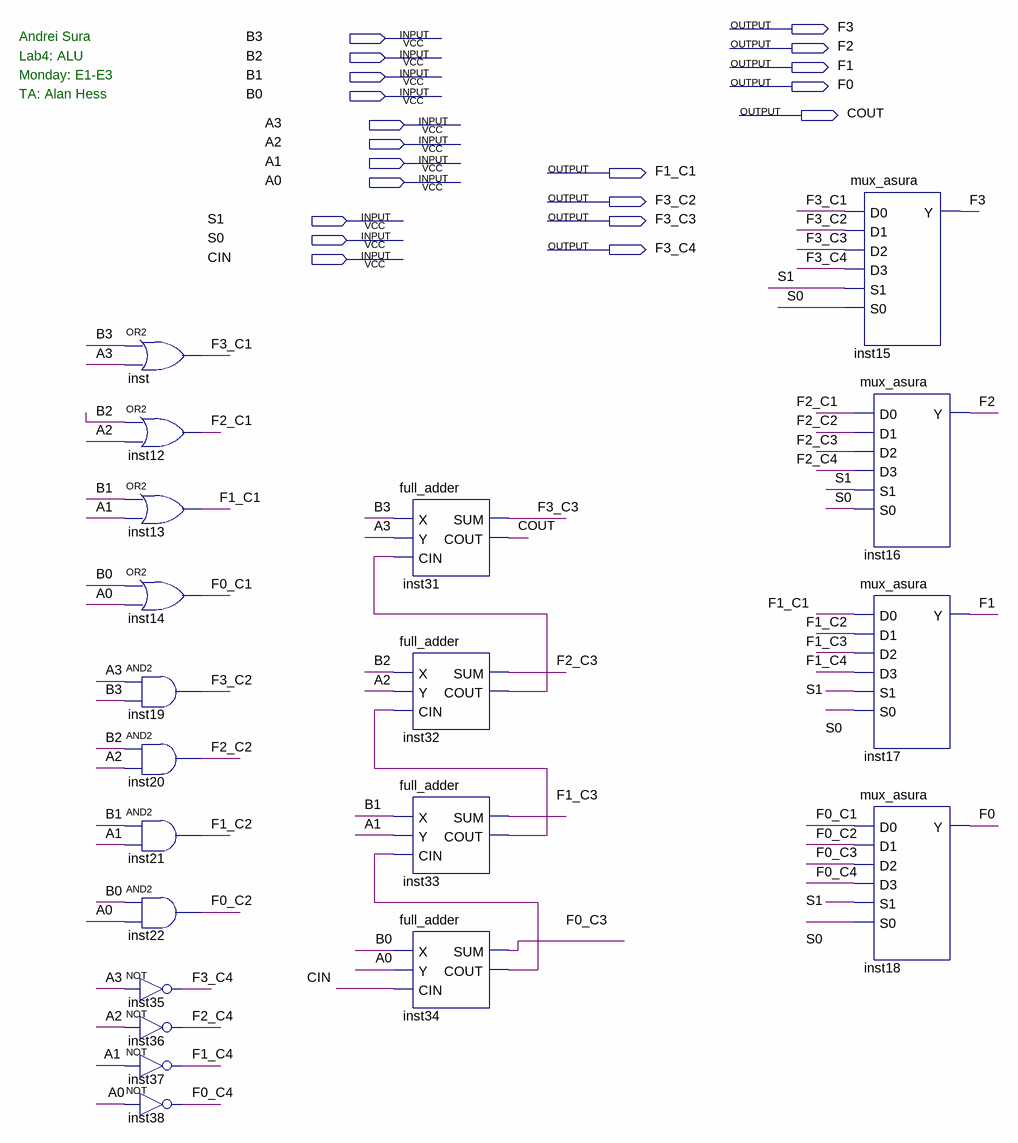
[diagram p0: schematic sheet]
// Quartus schematic lab_4_alu.bdf as structural Verilog: 20 symbols, 20 pins
module lab_4_alu (
  input  B3,
  input  B2,
  input  B1,
  input  B0,
  input  A3,
  input  A2,
  input  A1,
  input  A0,
  input  S1,
  input  S0,
  input  CIN,
  output F3,
  output F2,
  output F1,
  output F0,
  output COUT,
  output F1_C1,
  output F3_C2,
  output F3_C3,
  output F3_C4
);

  wire F0_C1, F0_C2, F0_C3, F0_C4, F1_C2, F1_C3, F1_C4, F2_C1, F2_C2, F2_C3, F2_C4, F3_C1, inst32_cout,
       inst33_cout, inst34_cout;

  or inst (F3_C1, B3, A3);
  or inst12 (F2_C1, B2, A2);
  or inst13 (F1_C1, B1, A1);
  or inst14 (F0_C1, B0, A0);
  and inst19 (F3_C2, A3, B3);
  and inst20 (F2_C2, B2, A2);
  and inst21 (F1_C2, B1, A1);
  and inst22 (F0_C2, B0, A0);
  not inst35 (F3_C4, A3);
  not inst36 (F2_C4, A2);
  not inst37 (F1_C4, A1);
  not inst38 (F0_C4, A0);
  full_adder inst31 (.X(B3), .Y(A3), .CIN(inst32_cout), .SUM(F3_C3), .COUT(COUT));
  full_adder inst32 (.X(B2), .Y(A2), .CIN(inst33_cout), .SUM(F2_C3), .COUT(inst32_cout));
  full_adder inst33 (.X(B1), .Y(A1), .CIN(inst34_cout), .SUM(F1_C3), .COUT(inst33_cout));
  full_adder inst34 (.X(B0), .Y(A0), .CIN(CIN), .SUM(F0_C3), .COUT(inst34_cout));
  mux_asura inst15 (.D0(F3_C1), .D1(F3_C2), .D2(F3_C3), .D3(F3_C4), .S1(S1), .S0(S0), .Y(F3));
  mux_asura inst16 (.D0(F2_C1), .D1(F2_C2), .D2(F2_C3), .D3(F2_C4), .S1(S1), .S0(S0), .Y(F2));
  mux_asura inst17 (.D0(F1_C1), .D1(F1_C2), .D2(F1_C3), .D3(F1_C4), .S1(S1), .S0(S0), .Y(F1));
  mux_asura inst18 (.D0(F0_C1), .D1(F0_C2), .D2(F0_C3), .D3(F0_C4), .S1(S1), .S0(S0), .Y(F0));

  // Notes on the sheet:
  //   Andrei Sura
  //   Lab4: ALU
  //   Monday: E1-E3
  //   TA: Alan Hess
endmodule
